# EAGLE design afron_atmega328_chassis (EAGLE 6.1)
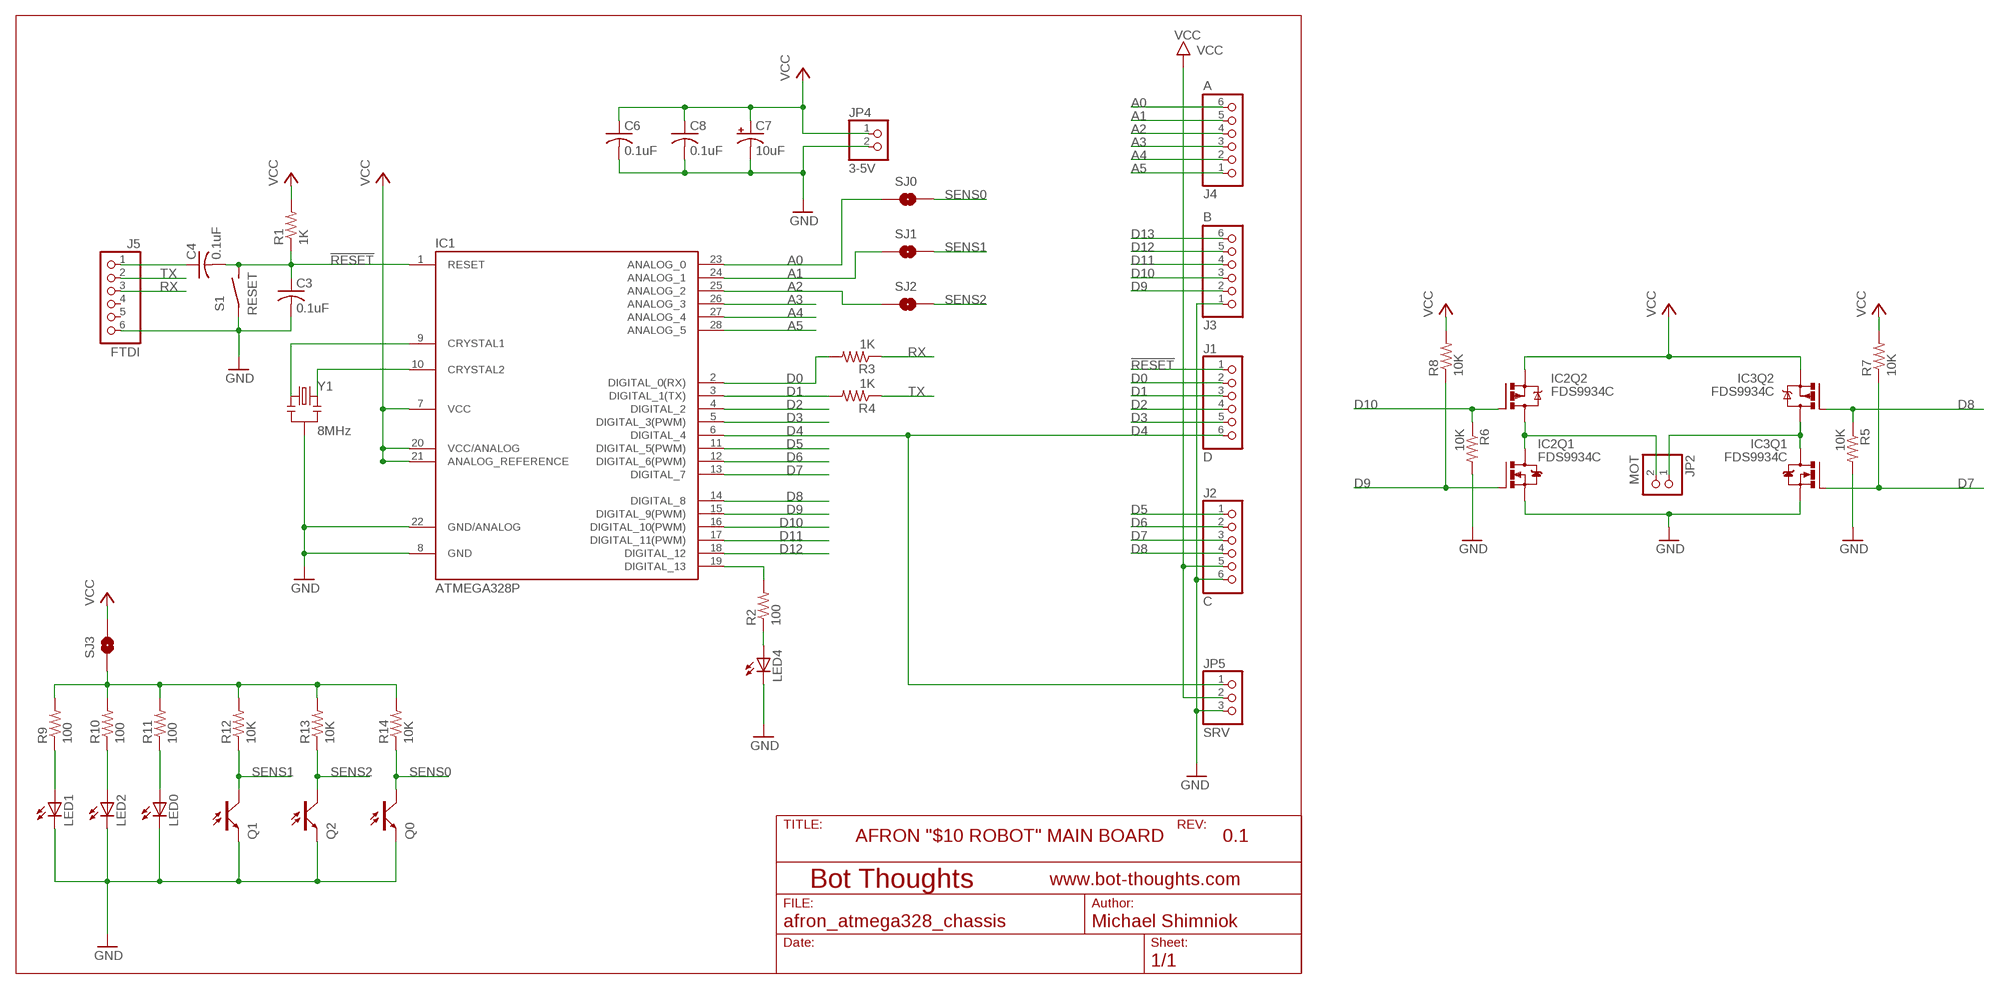
[diagram p0: schematic, sheet 1]

## Parts
C3  0.1uF  C-US050-024X044  [C050-024X044]
C4  0.1uF  C-US050-024X044  [C050-024X044]
C6  0.1uF  C-US050-024X044  [C050-024X044]
C7  10uF  CPOL-USE2.5-6  [E2,5-6]
C8  0.1uF  C-US050-024X044  [C050-024X044]
IC1  ATMEGA328P  ATMEGA168-PU  [DIL28-3]
IC2  FDS9934C  [SOIC8]
IC3  FDS9934C  [SOIC8]
J1  D  PINHD-1X06_2.54-S  [1X06-S]
J2  C  PINHD-1X06_2.54-S  [1X06-S]
J3  B  PINHD-1X06_2.54-S  [1X06-S]
J4  A  PINHD-1X06_2.54-S  [1X06-S]
J5  FTDI  PINHD-1X06_2.54-S  [1X06-S]
JP2  MOT  PINHD-1X02_2.54-S  [1X02-S]
JP4  3-5V  PINHD-1X02_2.54-S  [1X02-S]
JP5  SRV  PINHD-1X03_2.54-S  [1X03-S]
LED0  LED3MM  [LED3MM]
LED1  LED3MM  [LED3MM]
LED2  LED3MM  [LED3MM]
LED4  LED3MM  [LED3MM]
Q0  PHOTOTRANSISTOR3MM  [LED3MM]
Q1  PHOTOTRANSISTOR3MM  [LED3MM]
Q2  PHOTOTRANSISTOR3MM  [LED3MM]
R1  1K  R-US_0204/5  [0204/5]
R2  100  R-US_0204/5  [0204/5]
R3  1K  R-US_0204/5  [0204/5]
R4  1K  R-US_0204/5  [0204/5]
R5  10K  R-US_0204/5  [0204/5]
R6  10K  R-US_0204/5  [0204/5]
R7  10K  R-US_0204/5  [0204/5]
R8  10K  R-US_0204/5  [0204/5]
R9  100  R-US_0204/5  [0204/5]
R10  100  R-US_0204/5  [0204/5]
R11  100  R-US_0204/5  [0204/5]
R12  10K  R-US_0204/5  [0204/5]
R13  10K  R-US_0204/5  [0204/5]
R14  10K  R-US_0204/5  [0204/5]
S1  RESET  SPST_TACT2  [6MMTACTILE]
SJ0  SOLDERJUMPERTRACE  [SJ_2S-TRACE]
SJ1  SOLDERJUMPERTRACE  [SJ_2S-TRACE]
SJ2  SOLDERJUMPERTRACE  [SJ_2S-TRACE]
SJ3  SOLDERJUMPERTRACE  [SJ_2S-TRACE]
Y1  8MHz  RESONATORPTH  [RESONATOR-PTH]

## Nets
!RESET: C3.1 C4.2 IC1.1(RESET) J1.1 R1.1 S1.P$2(S)
A0: IC1.23(ANALOG_0) J4.6 SJ0.1
A1: IC1.24(ANALOG_1) J4.5 SJ1.1
A2: IC1.25(ANALOG_2) J4.4 SJ2.1
A3: IC1.26(ANALOG_3) J4.3
A4: IC1.27(ANALOG_4) J4.2
A5: IC1.28(ANALOG_5) J4.1
D0: IC1.2(DIGITAL_0(RX)) J1.2 R3.2
D1: IC1.3(DIGITAL_1(TX)) J1.3 R4.2
D2: IC1.4(DIGITAL_2) J1.4
D3: IC1.5(DIGITAL_3(PWM)) J1.5
D4: IC1.6(DIGITAL_4) J1.6 JP5.1
D5: IC1.11(DIGITAL_5(PWM)) J2.1
D6: IC1.12(DIGITAL_6(PWM)) J2.2
D7: IC1.13(DIGITAL_7) IC3.2(Q1:G) J2.3 R7.1
D8: IC1.14(DIGITAL_8) IC3.4(Q2:G) J2.4 R5.1
D9: IC1.15(DIGITAL_9(PWM)) IC2.2(Q1:G) J3.2 R8.1
D10: IC1.16(DIGITAL_10(PWM)) IC2.4(Q2:G) J3.3 R6.1
D11: IC1.17(DIGITAL_11(PWM)) J3.4
D12: IC1.18(DIGITAL_12) J3.5
D13: IC1.19(DIGITAL_13) J3.6 R2.2
GND: C3.2 C6.2 C7.- C8.2 IC1.8(GND) IC1.22(GND/ANALOG) IC2.1(Q1:S) IC3.1(Q1:S) J2.6 J3.1 J5.6 JP4.2 JP5.3 LED0.K(C) LED1.K(C) LED2.K(C) LED4.K(C) Q0.K(C) Q1.K(C) Q2.K(C) R5.2 R6.2 S1.P$1(P) Y1.2
MA: IC2.5(Q2:D) IC2.6(Q2:D) IC2.7(Q1:D) IC2.8(Q1:D) JP2.2
MB: IC3.5(Q2:D) IC3.6(Q2:D) IC3.7(Q1:D) IC3.8(Q1:D) JP2.1
N$1: LED0.A R11.1
N$2: IC1.9(CRYSTAL1) Y1.1
N$3: IC1.10(CRYSTAL2) Y1.3
N$4: C4.1 J5.1
N$5: LED2.A R10.1
N$6: LED4.A R2.1
N$7: LED1.A R9.1
N$8: R9.2 R10.2 R11.2 R12.2 R13.2 R14.2 SJ3.1
RX: J5.3 R3.1
SENS0: Q0.A R14.1 SJ0.2
SENS1: Q1.A R12.1 SJ1.2
SENS2: Q2.A R13.1 SJ2.2
TX: J5.2 R4.1
VCC: C6.1 C7.+ C8.1 IC1.7(VCC) IC1.20(VCC/ANALOG) IC1.21(ANALOG_REFERENCE) IC2.3(Q2:S) IC3.3(Q2:S) J2.5 JP4.1 JP5.2 R1.2 R7.2 R8.2 SJ3.2
Unconnected: J5.4 J5.5

## Notes on the sheet
- AFRON "$10 ROBOT" MAIN BOARD | 0.1

## Library data of the parts
C3 C4 C6 C8 = rcl:C-US: CAPACITOR, American symbol
C7 = rcl:CPOL-US: POLARIZED CAPACITOR, American symbol
IC1 = Arduino-AVR:ATMEGA168-PU
IC2 IC3 = mes_motor_driver:FDS9934C: Complementary MOSFET These dual N- and P-Channel enhancement mode power field effect transistors are produced using Fairchild Semiconductor’s advanced PowerTrench process that has been especially tailored to minimize on-state ressitance and yet maintain superior switching performance. These devices are well suited for low voltage and battery powered applications where low in-line power loss and fast switching are required. http://www.fairchildsemi.com/ds/FD/FDS9934C.pdf
J1-J5 = pinhead-2:PINHD-1X06: PIN HEADER
JP2 JP4 = pinhead-2:PINHD-1X02: PIN HEADER
JP5 = pinhead-2:PINHD-1X03: PIN HEADER
LED0 LED1 LED2 LED4 = led:LED: LED OSRAM: - CHIPLED LG R971, LG N971, LY N971, LG Q971, LY Q971, LO R971, LY R971 LH N974, LH R974 LS Q976, LO Q976, LY Q976 LO Q996 - Hyper CHIPLED LW Q18S LB Q993, LB Q99A, LB R99A - SideLED LS A670, LO A670, LY A670, LG A670, LP A670 LB A673, LV A673, LT A673, LW A673 LH A674 LY A675 LS A676, LA A676, LO A676, LY A676, LW A676 LS A679, LY A679, LG A679 - Hyper Micro SIDELED® LS Y876, LA Y876, LO Y876, LY Y876 LT Y87S - SmartLED LW L88C, LW L88S LB L89C, LB L89S, LG L890 LS L89K, LO L89K, LY L89K LS L896, LA L896, LO L896, LY L896 - TOPLED LS T670, LO T670, LY T670, LG T670, LP T670 LSG T670, LSP T670, LSY T670, LOP T670, LYG T670 LG T671, LOG T671, LSG T671 LB T673, LV T673, LT T673, LW T673 LH T674 LS T676, LA T676, LO T676, LY T676, LB T676, LH T676, LSB T676, LW T676 LB T67C, LV T67C, LT T67C, LS T67K, LO T67K, LY T67K, LW E67C LS E67B, LA E67B, LO E67B, LY E67B, LB E67C, LV E67C, LT E67C LW T67C LS T679, LY T679, LG T679 LS T770, LO T770, LY T770, LG T770, LP T770 LB T773, LV T773, LT T773, LW T773 LH T774 LS E675, LA E675, LY E675, LS T675 LS T776, LA T776, LO T776, LY T776, LB T776 LHGB T686 LT T68C, LB T68C - Hyper Mini TOPLED® LB M676 - Mini TOPLED Santana® LG M470 LS M47K, LO M47K, LY M47K Source: http://www.osram.convergy.de LUXEON: - LUMILED® LXK2-PW12-R00, LXK2-PW12-S00, LXK2-PW14-U00, LXK2-PW14-V00 LXK2-PM12-R00, LXK2-PM12-S00, LXK2-PM14-U00 LXK2-PE12-Q00, LXK2-PE12-R00, LXK2-PE12-S00, LXK2-PE14-T00, LXK2-PE14-U00 LXK2-PB12-K00, LXK2-PB12-L00, LXK2-PB12-M00, LXK2-PB14-N00, LXK2-PB14-P00, LXK2-PB14-Q00 LXK2-PR12-L00, LXK2-PR12-M00, LXK2-PR14-Q00, LXK2-PR14-R00 LXK2-PD12-Q00, LXK2-PD12-R00, LXK2-PD12-S00 LXK2-PH12-R00, LXK2-PH12-S00 LXK2-PL12-P00, LXK2-PL12-Q00, LXK2-PL12-R00 Source: www.luxeon.com KINGBRIGHT: KA-3528ASYC Source: www.kingbright.com
Q0 Q1 Q2 = mes_opto:PHOTOTRANSISTOR: Phototransistor
R1-R14 = resistor:R-US_: RESISTOR, American symbol
S1 = mes_electromech:SPST: SPST SWITCH
SJ0 SJ1-SJ3 = SparkFun:SOLDERJUMPER: Solder Jumper Standard SMD solder jumper. Used to automate production. Two varients : Normally Open and Normally Closed are the same, but have different paste layers. NC will have a large amount of paste and should jumper during reflow.
Y1 = SparkFun:RESONATOR: Resonator Small SMD resonator. This is the itty bitty 10/20MHz resonators with built in caps. CSTCE10M0G55 and CSTCE20M0V53. Footprint has been reviewed closely but hasn't been tested yet.

## Board
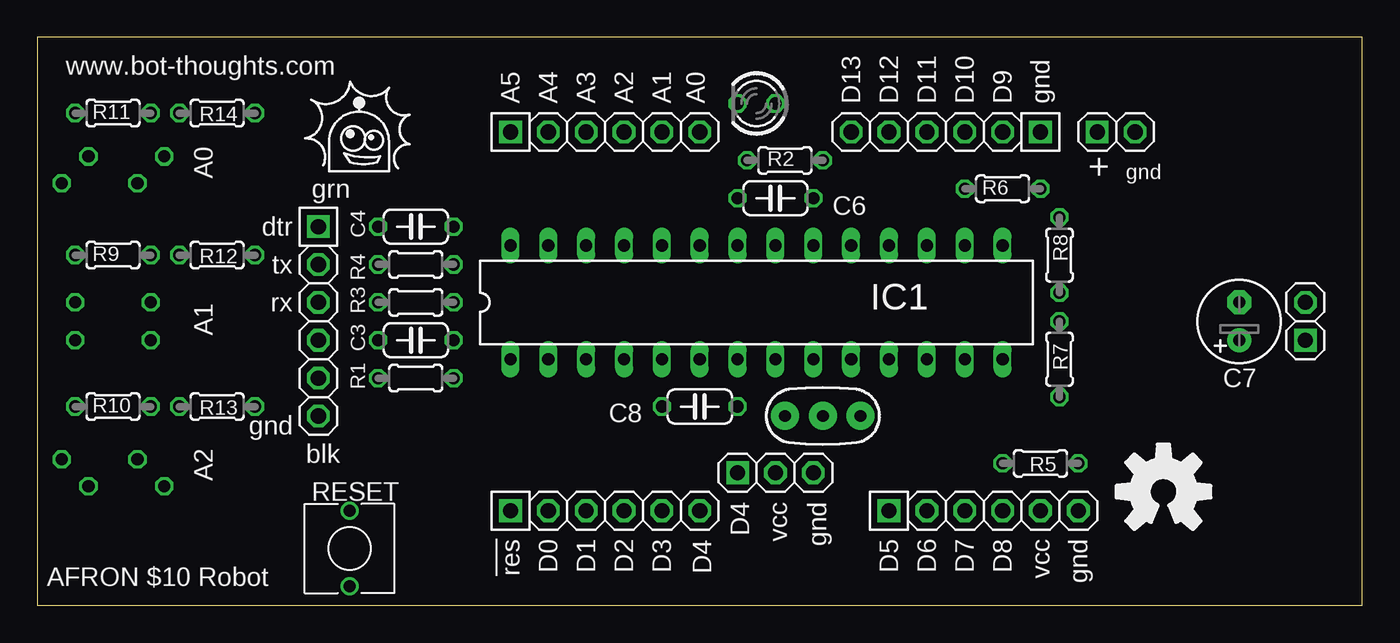
[diagram p1: board, top side]
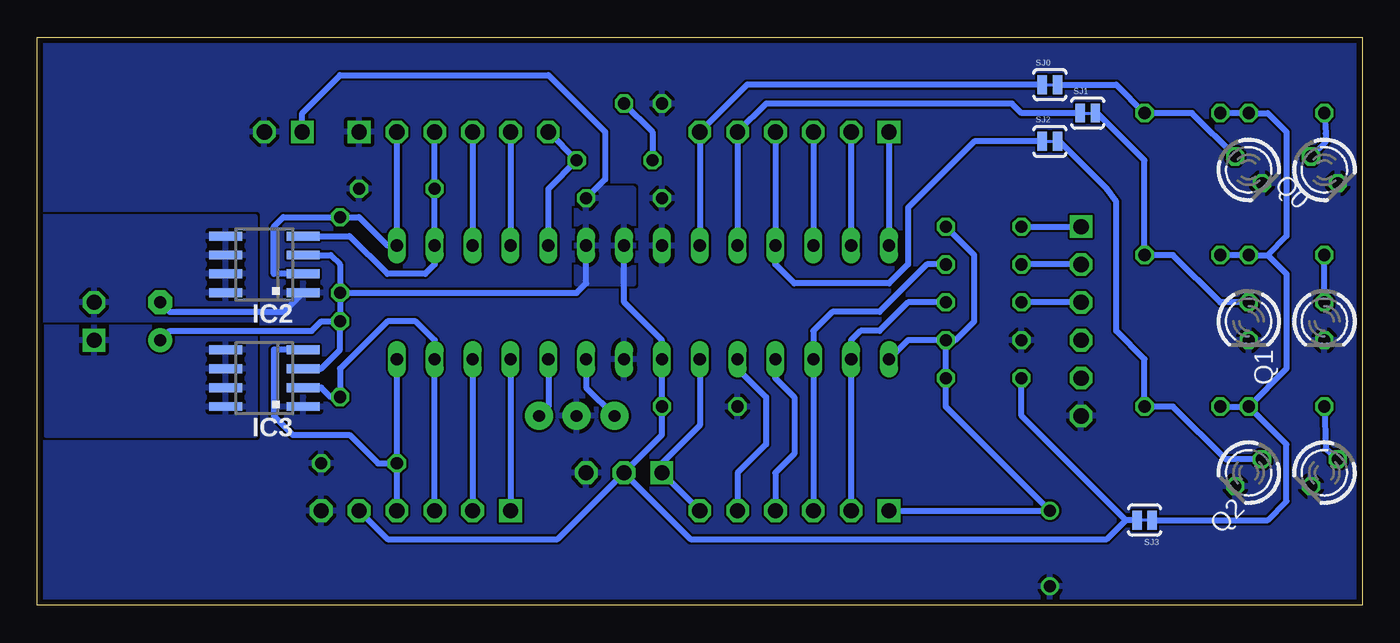
[diagram p2: board, bottom side, seen from below]

Size 88.9 x 38.1 mm. Coordinates in mm from the lower left corner, seen from the top.
Outline: 88.9,0 88.9,38.1 0,38.1 0,0 88.9,0
Copper layers (1*16): Top 0.0356mm / dielectric 1.5011mm / Bottom 0.0356mm
Design rules: minimum track width 6mil, minimum drill 13mil, track to track 6mil, track to pad 6mil, pad to pad 6mil, via to via 6mil, smd to smd 6mil, copper to edge 15mil, drill to drill 6mil, minimum pad ring 7mil, minimum via ring 7mil, stop-mask expansion 4mil, vias tented up to drill 0mil, thermal gap 10mil

### Footprints (pad centres in the part's own frame; a part is rotated, then mirrored left to right if it is on the bottom)
C050-024X044 = drill 0.813 octagon: 1 -2.54,0; 2 2.54,0
E2,5-6 = drill 0.813 pad 1.6: + -1.27,0 | drill 0.813 pad 1.6 octagon: - 1.27,0
DIL28-3 = drill 0.813 long: 1 -16.51,-3.81; 2 -13.97,-3.81; 3 -11.43,-3.81; 4 -8.89,-3.81; 5 -6.35,-3.81; 6 -3.81,-3.81; 7 -1.27,-3.81; 8 1.27,-3.81; 9 3.81,-3.81; 10 6.35,-3.81; 11 8.89,-3.81; 12 11.43,-3.81; 13 13.97,-3.81; 14 16.51,-3.81; 15 16.51,3.81; 16 13.97,3.81; 17 11.43,3.81; 18 8.89,3.81; 19 6.35,3.81; 20 3.81,3.81; 21 1.27,3.81; 22 -1.27,3.81; 23 -3.81,3.81; 24 -6.35,3.81; 25 -8.89,3.81; 26 -11.43,3.81; 27 -13.97,3.81; 28 -16.51,3.81
SOIC8 = smd 0.6 x 2.2: 1 -1.905,-2.6; 2 -0.635,-2.6; 3 0.635,-2.6; 4 1.905,-2.6; 5 1.905,2.6; 6 0.635,2.6; 7 -0.635,2.6; 8 -1.905,2.6
1X06-S = drill 1.016 square: 1 -6.35,0 | drill 1.016 octagon: 2 -3.81,0; 3 -1.27,0; 4 1.27,0; 5 3.81,0; 6 6.35,0
1X02-S = drill 1.016 square: 1 -1.27,0 | drill 1.016 octagon: 2 1.27,0
1X03-S = drill 1.016 square: 1 -2.54,0 | drill 1.016 octagon: 2 0,0; 3 2.54,0
LED3MM = drill 0.813 octagon: A -1.27,0; K 1.27,0
0204/5 = drill 0.813 octagon: 1 -2.54,0; 2 2.54,0
6MMTACTILE = drill 0.8: P$1 -2.54,0; P$2 2.54,0
SJ_2S-TRACE = smd 0.635 x 1.27: 1 -0.508,0; 2 0.508,0
RESONATOR-PTH = drill 0.8 pad 1.88: 1 -2.54,0; 2 0,0; 3 2.54,0

### Placement (x,y rotation side)
C3  25.4,17.78 180 top
C4  25.4,25.4 0 top
C6  49.53,27.3 180 top
C7  80.64,19.05 90 top
C8  44.45,13.34 180 top
IC1  48.26,20.32 0 top
IC2  73.66,22.86 90 bottom
IC3  73.66,15.24 90 bottom
J1  38.1,6.35 0 top
J2  63.5,6.35 0 top
J3  60.96,31.75 180 top
J4  38.1,31.75 0 top
J5  18.86,19.05 270 top
JP2  85.09,19.05 90 top
JP4  72.39,31.75 0 top
JP5  49.53,8.89 0 top
LED0  2.54,29.21 315 bottom
LED1  2.54,19.05 270 bottom
LED2  2.54,8.89 225 bottom
LED4  48.26,33.66 180 top
Q0  7.62,29.21 315 bottom
Q1  7.62,19.05 270 bottom
Q2  7.62,8.89 225 bottom
R1  25.4,15.24 180 top
R2  50.16,29.84 0 top
R3  25.4,20.32 0 top
R4  25.4,22.86 0 top
R5  67.31,9.53 0 top
R6  64.77,27.94 0 top
R7  68.58,16.51 90 top
R8  68.58,23.5 270 top
R9  5.08,23.5 0 top
R10  5.08,13.34 0 top
R11  5.08,33.02 0 top
R12  12.06,23.5 180 top
R13  12.06,13.34 180 top
R14  12.06,33.02 180 top
S1  20.95,3.81 90 top
SJ0  20.95,34.92 0 bottom
SJ1  18.41,33.02 0 bottom
SJ2  20.95,31.11 0 bottom
SJ3  14.61,5.71 180 bottom
Y1  52.7,12.7 0 top

### Tracks (layer width: path | path; a pad name or v marks a point on that pad's centre or on a via)
!RESET
  Bottom 0.406: C3.1 30.48,17.78 IC1.1 | C3.1 R1.1 27.94,13.34 S1.P$2 J1.1 | C3.1 27.3,17.78 26.04,19.05 26.04,23.5 C4.2
A0
  Bottom 0.406: IC1.23 J4.6 41.27,34.92 SJ0.1
A1
  Bottom 0.406: IC1.24 J4.5 40.01,33.66 23.5,33.66 22.86,33.02 SJ1.1
A2
  Bottom 0.406: J4.4 IC1.25 39.37,22.86 38.1,21.59 31.75,21.59 30.48,22.86 30.48,26.67 26.04,31.11 SJ2.1
A3
  Bottom 0.406: J4.3 IC1.26
A4
  Bottom 0.406: J4.2 IC1.27
A5
  Bottom 0.406: J4.1 IC1.28
D0
  Bottom 0.406: J1.2 IC1.2 34.29,17.78 33.66,18.41 32.38,18.41 30.48,20.32 R3.2
D1
  Bottom 0.406: J1.3 IC1.3 36.83,18.41 35.56,19.68 32.38,19.68 29.21,22.86 R4.2
D2
  Bottom 0.406: IC1.4 39.37,15.24 38.1,13.97 38.1,10.16 39.37,8.89 J1.4
D3
  Bottom 0.406: IC1.5 41.91,15.88 40.01,13.97 40.01,10.79 41.91,8.89 J1.5
D4
  Bottom 0.406: IC1.6 44.45,12.06 46.99,9.53 JP5.1 J1.6
D5
  Bottom 0.406: IC1.11 J2.1
D6
  Bottom 0.406: IC1.12 J2.2
D7
  Bottom 0.406: J2.3 IC1.13 62.23,17.78 63.5,19.05 65.41,19.05 68.58,15.88 R7.1 69.22,13.97 69.85,14.61 IC3.2
D8
  Bottom 0.406: IC3.4 73.03,17.14 73.03,12.7 71.75,11.43 67.94,11.43 66.04,9.53 R5.1 | R5.1 IC1.14 | J2.4 R5.1
D9
  Bottom 0.406: J3.2 IC1.15 65.41,24.13 67.31,26.04 R8.1 72.39,26.04 73.03,25.4 73.03,22.23 IC2.2
D10
  Bottom 0.406: J3.3 R6.1 IC1.16 62.23,22.86 62.87,22.23 65.41,22.23 67.94,24.77 IC2.4
D11
  Bottom 0.406: J3.4 IC1.17
D12
  Bottom 0.406: J3.5 IC1.18
D13
  Bottom 0.406: IC1.19 54.61,27.94 R2.2 J3.6
GND
  Bottom 0.406: C7.- 80.01,19.68 72.33,19.68 IC2.1
  pour Bottom (rank 4): 0,0 0,38.42 88.9,38.42 88.9,0
MA
  pour Bottom: 74.3,26.04 88.9,26.04 88.9,19.18 74.3,19.18
MB
  pour Bottom (rank 2): 74.3,19.05 88.27,19.05 88.27,11.43 74.3,11.43
N$1
  Bottom 0.406: R11.1 2.46,31.66 2.46,31.09 LED0.A
N$2
  Bottom 0.406: IC1.9 52.07,14.61 Y1.1
N$3
  Bottom 0.406: IC1.10 54.61,13.34 Y1.3
N$4
  Bottom 0.406: C4.1 J5.1
N$5
  Bottom 0.406: R10.1 2.46,10.48 LED2.A
N$6
  Bottom 0.406: LED4.A 47.62,31.75 R2.1
N$7
  Bottom 0.406: LED1.A R9.1
N$8
  Bottom 0.406: 6.35,23.5 5.08,24.77 5.08,31.75 6.35,33.02 R11.2 R14.2 | R12.2 R9.2 6.35,23.5 | 6.35,23.5 5.08,22.23 5.08,15.88 R10.2 | R13.2 R10.2 | SJ3.1 6.35,5.71 5.08,6.99 5.08,10.79 R10.2
RX
  Bottom 0.406: J5.3 R3.1
SENS0
  Bottom 0.406: Q0.A 11.43,33.02 R14.1 16.51,34.92 SJ0.2
SENS1
  Bottom 0.406: Q1.A 9.53,20.32 12.7,23.5 R12.1 14.61,29.84 17.78,33.02 SJ1.2
SENS2
  Bottom 0.406: SJ2.2 20.32,31.11 17.14,27.94 16.51,27.08 16.51,18.41 14.61,16.51 R13.1 12.7,13.34 9.15,9.79 Q2.A
TX
  Bottom 0.406: J5.2 R4.1
VCC
  Bottom 0.406: IC1.21 49.53,20.32 46.99,17.78 IC1.7 C8.1 46.99,11.43 JP5.2 | 15.88,5.71 22.86,12.7 R1.2 | JP5.2 45.09,4.45 17.14,4.45 15.88,5.71 | SJ3.2 15.88,5.71 | J2.5 65.41,4.45 53.98,4.45 JP5.2 | R8.2 52.7,20.95 52.07,21.59 IC1.20 | R8.2 R7.2 | IC3.3 69.85,15.88 68.58,17.14 R7.2 | IC2.3 69.22,23.5 68.58,22.86 R8.2 | C7.+ 80.01,18.41 70.48,18.41 69.85,19.05 R7.2 | JP4.1 71.12,33.02 68.58,35.56 54.61,35.56 50.8,31.75 50.8,28.57 C6.1
  pour Bottom: 48.9,27.94 51.44,27.94 52.7,26.67 52.7,21.59 48.9,21.59

### Text on the board
tPlace: www.bot-thoughts.com | AFRON $10 Robot
tNames: A5 | A4 | A3 | A2 | A1 | A0 | D13 | D12 | D11 | D10 | D9 | gnd | A0 | + | gnd | grn | dtr | tx | rx | A1 | gnd | blk | A2 | RESET | D4 | vcc | gnd | !res | D0 | D1 | D2 | D3 | D4 | D5 | D6 | D7 | D8 | vcc | gnd